# Altium schematic sheet fmc_connector.SchDoc: FMC low-pin count connector
size A3; CheckedBy: vanderby; CompanyName: CERN; DrawnBy: mcattin; Engineer: mcattin; Organization: CERN; Address1: European Organization for Nuclear Research; Address2: CH-1211 Genève 23 - Switzerland; DocumentNumber: 1; Revision: -; SheetNumber: 1; SheetTotal: 5; EDA_Number: EDA-02064-V1-0; Projet: FmcDIO16chTTLa; ModifiedBy: mcattin; CreateDate: 11/04/2009; CheckedDate: 11/26/2009; Title2: Connection with FMC carrier; DivGrp: BE-CO-HT; Designer: mcattin; ModifiedDate: -
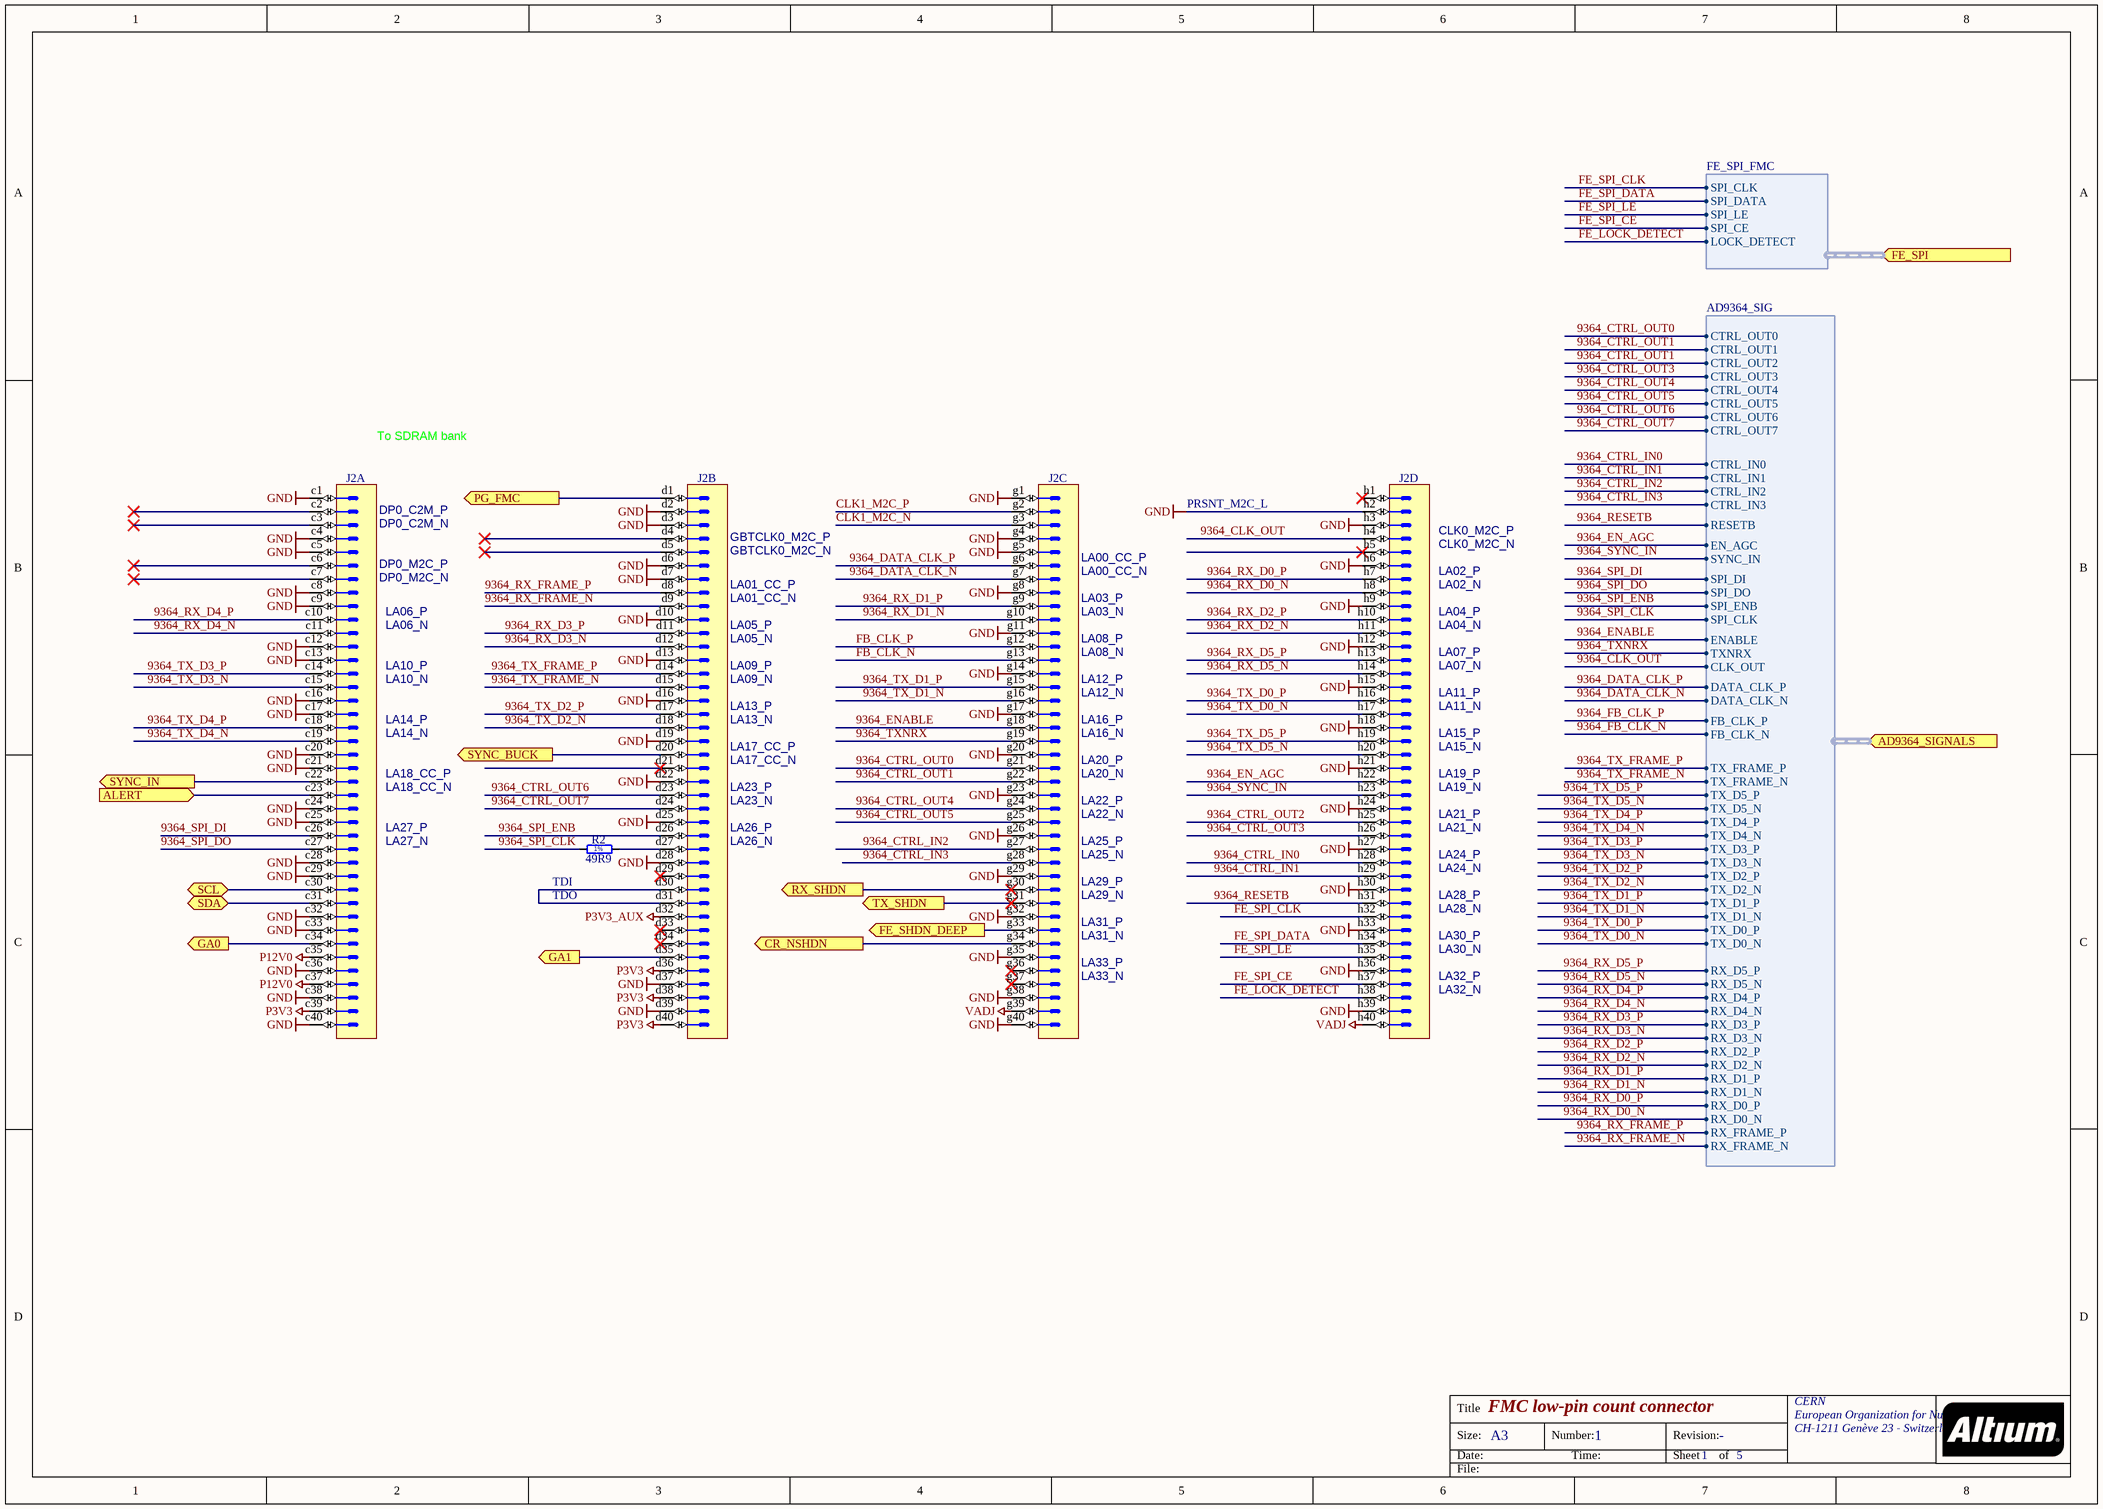
[diagram p0: fmc_connector.SchDoc]

## Parts
J2  VITA 57  [SAMTEC_ASP-127797-01]  (value not drawn)  (parts A,B,C,D of 4)
R2  49R9  [RESC1005X40N]

## Ports
AD9364_SIGNALS (in, harness AD9364_SIG), ALERT (in), CR_NSHDN (out), FE_SHDN_DEEP (out), FE_SPI (in, harness FE_SPI_FMC), GA0 (out), GA1 (out), PG_FMC (out), RX_SHDN (out), SCL (bidir), SDA (bidir), SYNC_BUCK (out), SYNC_IN (out), TX_SHDN (out)

## Harnesses
AD9364_SIG: CTRL_OUT0, CTRL_OUT1, CTRL_OUT2, CTRL_OUT3, CTRL_OUT4, CTRL_OUT5, CTRL_OUT6, CTRL_OUT7, CTRL_IN0, CTRL_IN1, CTRL_IN2, CTRL_IN3, RESETB, EN_AGC, SYNC_IN, SPI_DI, SPI_DO, SPI_ENB, SPI_CLK, ENABLE, TXNRX, CLK_OUT, DATA_CLK_P, DATA_CLK_N, FB_CLK_P, FB_CLK_N, TX_FRAME_P, TX_FRAME_N, TX_D5_P, TX_D5_N, TX_D4_P, TX_D4_N, TX_D3_P, TX_D3_N, TX_D2_P, TX_D2_N, TX_D1_P, TX_D1_N, TX_D0_P, TX_D0_N, RX_D5_P, RX_D5_N, RX_D4_P, RX_D4_N, RX_D3_P, RX_D3_N, RX_D2_P, RX_D2_N, RX_D1_P, RX_D1_N, RX_D0_P, RX_D0_N, RX_FRAME_P, RX_FRAME_N
FE_SPI_FMC: SPI_CLK, SPI_DATA, SPI_LE, SPI_CE, LOCK_DETECT

## Nets
GND: J2.c1 J2.c4 J2.c5 J2.c8 J2.c9 J2.c12 J2.c13 J2.c16 J2.c17 J2.c20 J2.c21 J2.c24 J2.c25 J2.c28 J2.c29 J2.c32 J2.c33 J2.c36 J2.c38 J2.c40 J2.d2 J2.d3 J2.d6 J2.d7 J2.d10 J2.d13 J2.d16 J2.d19 J2.d22 J2.d25 J2.d28 J2.d37 J2.d39 J2.g1 J2.g4 J2.g5 J2.g8 J2.g11 J2.g14 J2.g17 J2.g20 J2.g23 J2.g26 J2.g29 J2.g32 J2.g35 J2.g38 J2.g40 J2.h2 J2.h3 J2.h6 J2.h9 J2.h12 J2.h15 J2.h18 J2.h21 J2.h24 J2.h27 J2.h30 J2.h33 J2.h36 J2.h39
P3V3: J2.c39 J2.d36 J2.d38 J2.d40
P3V3_AUX: J2.d32
P12V0: J2.c35 J2.c37
VADJ: J2.g39 J2.h40
9364_CLK_OUT: J2.h4 ; port AD9364_SIGNALS.CLK_OUT
9364_CTRL_IN0: J2.h28 ; port AD9364_SIGNALS.CTRL_IN0
9364_CTRL_IN1: J2.h29 ; port AD9364_SIGNALS.CTRL_IN1
9364_CTRL_IN2: J2.g27 ; port AD9364_SIGNALS.CTRL_IN2
9364_CTRL_IN3: J2.g28 ; port AD9364_SIGNALS.CTRL_IN3
9364_CTRL_OUT0: J2.g21 ; port AD9364_SIGNALS.CTRL_OUT0
9364_CTRL_OUT1: J2.g22 ; port AD9364_SIGNALS.CTRL_OUT1, port AD9364_SIGNALS.CTRL_OUT2
9364_CTRL_OUT2: J2.h25
9364_CTRL_OUT3: J2.h26 ; port AD9364_SIGNALS.CTRL_OUT3
9364_CTRL_OUT4: J2.g24 ; port AD9364_SIGNALS.CTRL_OUT4
9364_CTRL_OUT5: J2.g25 ; port AD9364_SIGNALS.CTRL_OUT5
9364_CTRL_OUT6: J2.d23 ; port AD9364_SIGNALS.CTRL_OUT6
9364_CTRL_OUT7: J2.d24 ; port AD9364_SIGNALS.CTRL_OUT7
9364_DATA_CLK_N: J2.g7 ; port AD9364_SIGNALS.DATA_CLK_N
9364_DATA_CLK_P: J2.g6 ; port AD9364_SIGNALS.DATA_CLK_P
9364_EN_AGC: J2.h22 ; port AD9364_SIGNALS.EN_AGC
9364_ENABLE: J2.g18 ; port AD9364_SIGNALS.ENABLE
9364_FB_CLK_N: port AD9364_SIGNALS.FB_CLK_N
9364_FB_CLK_P: port AD9364_SIGNALS.FB_CLK_P
9364_RESETB: J2.h31 ; port AD9364_SIGNALS.RESETB
9364_RX_D0_N: J2.h8 ; port AD9364_SIGNALS.RX_D0_N
9364_RX_D0_P: J2.h7 ; port AD9364_SIGNALS.RX_D0_P
9364_RX_D1_N: J2.g10 ; port AD9364_SIGNALS.RX_D1_N
9364_RX_D1_P: J2.g9 ; port AD9364_SIGNALS.RX_D1_P
9364_RX_D2_N: J2.h11 ; port AD9364_SIGNALS.RX_D2_N
9364_RX_D2_P: J2.h10 ; port AD9364_SIGNALS.RX_D2_P
9364_RX_D3_N: J2.d12 ; port AD9364_SIGNALS.RX_D3_N
9364_RX_D3_P: J2.d11 ; port AD9364_SIGNALS.RX_D3_P
9364_RX_D4_N: J2.c11 ; port AD9364_SIGNALS.RX_D4_N
9364_RX_D4_P: J2.c10 ; port AD9364_SIGNALS.RX_D4_P
9364_RX_D5_N: J2.h14 ; port AD9364_SIGNALS.RX_D5_N
9364_RX_D5_P: J2.h13 ; port AD9364_SIGNALS.RX_D5_P
9364_RX_FRAME_N: J2.d9 ; port AD9364_SIGNALS.RX_FRAME_N
9364_RX_FRAME_P: J2.d8 ; port AD9364_SIGNALS.RX_FRAME_P
9364_SPI_CLK: R2.1 ; port AD9364_SIGNALS.SPI_CLK
9364_SPI_DI: J2.c26 ; port AD9364_SIGNALS.SPI_DI
9364_SPI_DO: J2.c27 ; port AD9364_SIGNALS.SPI_DO
9364_SPI_ENB: J2.d26 ; port AD9364_SIGNALS.SPI_ENB
9364_SYNC_IN: J2.h23 ; port AD9364_SIGNALS.SYNC_IN
9364_TX_D0_N: J2.h17 ; port AD9364_SIGNALS.TX_D0_N
9364_TX_D0_P: J2.h16 ; port AD9364_SIGNALS.TX_D0_P
9364_TX_D1_N: J2.g16 ; port AD9364_SIGNALS.TX_D1_N
9364_TX_D1_P: J2.g15 ; port AD9364_SIGNALS.TX_D1_P
9364_TX_D2_N: J2.d18 ; port AD9364_SIGNALS.TX_D2_N
9364_TX_D2_P: J2.d17 ; port AD9364_SIGNALS.TX_D2_P
9364_TX_D3_N: J2.c15 ; port AD9364_SIGNALS.TX_D3_N
9364_TX_D3_P: J2.c14 ; port AD9364_SIGNALS.TX_D3_P
9364_TX_D4_N: J2.c19 ; port AD9364_SIGNALS.TX_D4_N
9364_TX_D4_P: J2.c18 ; port AD9364_SIGNALS.TX_D4_P
9364_TX_D5_N: J2.h20 ; port AD9364_SIGNALS.TX_D5_N
9364_TX_D5_P: J2.h19 ; port AD9364_SIGNALS.TX_D5_P
9364_TX_FRAME_N: J2.d15 ; port AD9364_SIGNALS.TX_FRAME_N
9364_TX_FRAME_P: J2.d14 ; port AD9364_SIGNALS.TX_FRAME_P
9364_TXNRX: J2.g19 ; port AD9364_SIGNALS.TXNRX
ALERT: J2.c23 ; port ALERT
CLK1_M2C_N: J2.g3
CLK1_M2C_P: J2.g2
CR_NSHDN: J2.g34 ; port CR_NSHDN
FB_CLK_N: J2.g13
FB_CLK_P: J2.g12
FE_LOCK_DETECT: J2.h38 ; port FE_SPI.LOCK_DETECT
FE_SHDN_DEEP: J2.g33 ; port FE_SHDN_DEEP
FE_SPI_CE: J2.h37 ; port FE_SPI.SPI_CE
FE_SPI_CLK: J2.h32 ; port FE_SPI.SPI_CLK
FE_SPI_DATA: J2.h34 ; port FE_SPI.SPI_DATA
FE_SPI_LE: J2.h35 ; port FE_SPI.SPI_LE
GA0: J2.c34 ; port GA0
GA1: J2.d35 ; port GA1
PG_FMC: J2.d1 ; port PG_FMC
RX_SHDN: J2.g30 ; port RX_SHDN
SCL: J2.c30 ; port SCL
SDA: J2.c31 ; port SDA
SYNC_BUCK: J2.d20 ; port SYNC_BUCK
SYNC_IN: J2.c22 ; port SYNC_IN
TX_SHDN: J2.g31 ; port TX_SHDN
NetJ2_d27: J2.d27 R2.2
NetJ2_d30: J2.d30 J2.d31

Not connected (* = marked no-connect by the designer): J2 c2* c3* c6* c7* d4* d5* d21* d29* d33* d34* g36* g37* h1* h5*

## Notes on the sheet
- To SDRAM bank
- (near J2) DP0_C2M_P
- PRSNT_M2C_L
- (near J2) DP0_C2M_N
- (near J2) DP0_M2C_P
- (near J2) DP0_M2C_N
- (near J2) LA01_CC_P
- (near J2) GBTCLK0_M2C_P
- (near J2) GBTCLK0_M2C_N
- (near J2) LA00_CC_P
- (near J2) LA00_CC_N
- (near J2) CLK0_M2C_P
- (near J2) CLK0_M2C_N
- (near J2) LA02_P
- (near J2) LA02_N
- (near J2) LA06_P
- (near J2) LA06_N
- (near J2) LA01_CC_N
- (near J2) LA05_P
- (near J2) LA05_N
- (near J2) LA03_P
- (near J2) LA03_N
- (near J2) LA08_P
- (near J2) LA04_P
- (near J2) LA04_N
- (near J2) LA10_P
- (near J2) LA10_N
- (near J2) LA14_P
- (near J2) LA09_P
- (near J2) LA09_N
- (near J2) LA13_P
- (near J2) LA13_N
- (near J2) LA08_N
- (near J2) LA12_P
- (near J2) LA12_N
- (near J2) LA16_P
- (near J2) LA07_P
- (near J2) LA07_N
- (near J2) LA11_P
- (near J2) LA11_N
- (near J2) LA14_N
- (near J2) LA18_CC_P
- (near J2) LA17_CC_P
- (near J2) LA17_CC_N
- (near J2) LA16_N
- (near J2) LA20_P
- (near J2) LA20_N
- (near J2) LA15_P
- (near J2) LA15_N
- (near J2) LA19_P
- (near J2) LA18_CC_N
- (near J2) LA27_P
- (near J2) LA27_N
- (near J2) LA23_P
- (near J2) LA23_N
- (near J2) LA26_P
- (near J2) LA26_N
- (near J2) LA22_P
- (near J2) LA22_N
- (near J2) LA25_P
- (near J2) LA25_N
- (near J2) LA19_N
- (near J2) LA21_P
- (near J2) LA21_N
- (near J2) LA24_P
- (near R2) TDI
- (near R2) TDO
- (near J2) LA29_P
- (near J2) LA29_N
- (near J2) LA24_N
- (near J2) LA28_P
- (near J2) LA28_N
- (near J2) LA31_P
- (near J2) LA31_N
- (near J2) LA33_P
- (near J2) LA33_N
- (near J2) LA30_P
- (near J2) LA30_N
- (near J2) LA32_P
- (near J2) LA32_N
- Title
- Size:
- Date:
- A3
- Number:
- Time:
- Revision:
- Sheet
- of
- File:
- (in symbol R0402_49R9_1%_0.0625W_100PPM) 1%

## Library data of the parts
J2 = SAMTEC_ASP-127797-01: Connector VITA 57, 160 Male contacts in 4 row cdgh; Part Description: 160 contacts (4 rows cdgh) Surface Mount Male Connector, VITA 57; Manufacturer: SAMTEC; Manufacturer Part Number: ASP-134488-01; Part Number: SAMTEC_ASP-127797-01; Component Kind: Standard; Component Type: Standard; Designator: Connector VITA 57 160 Male (cdgh); Library Reference: Connector VITA 57 160 Male (cdgh); Pin Count: 160; Family: VITA 57; Mounted: Yes; Socket: No; SMD: Yes; Status: None; ComponentHeight: 6.1mm; Datasheet: \\cern.ch\dfs\Applications\Altium\Datasheets\SAMTEC_ASP-127797-01.pdf; HelpURL: \\cern.ch\dfs\Applications\Altium\Datasheets\SAMTEC_ASP-127797-01.pdf; Author: CERN DEM JLC; CreateDate: 9/24/2009; LatestRevisionDate: 9/24/2009; Table: SAMTEC
R2 = R0402_49R9_1%_0.0625W_100PPM: Resistor - 1%; Part Description: General Purpose Thick Film Chip Resistor; Manufacturer: GENERIC; Manufacturer1 Part Number: 232270674999L or RC0402FR-0749R9L; TC: ±100ppm/°C; PressFit: No; Part Number: R0402_49R9_1%_0.0625W_100PPM; Component Kind: Standard; Component Type: Standard; Pin Count: 2; Value: 49R9; Status: Not Recommended; Power: 0.0625W; Tolerance: ±1%; Manufacturer Part Number: R0402_49R9_1%_0.0625W_100PPM; Case: 0402; Mounted: Yes; Sense: No; Socket: No; SMD: Yes; Manufacturer1 Example: YAGEO PHYCOMP; Manufacturer1 ComponentHeight: 0.4mm; HelpURL: \\cern.ch\dfs\Applications\Altium\Datasheets\R0402_Phycomp_RC0402.pdf; Author: CERN DEM JLC; CreateDate: 24.10.2012; LatestRevisionDate: 24.10.2012